# Altium schematic sheet 驱动PCB第4次.SchDoc
size A4
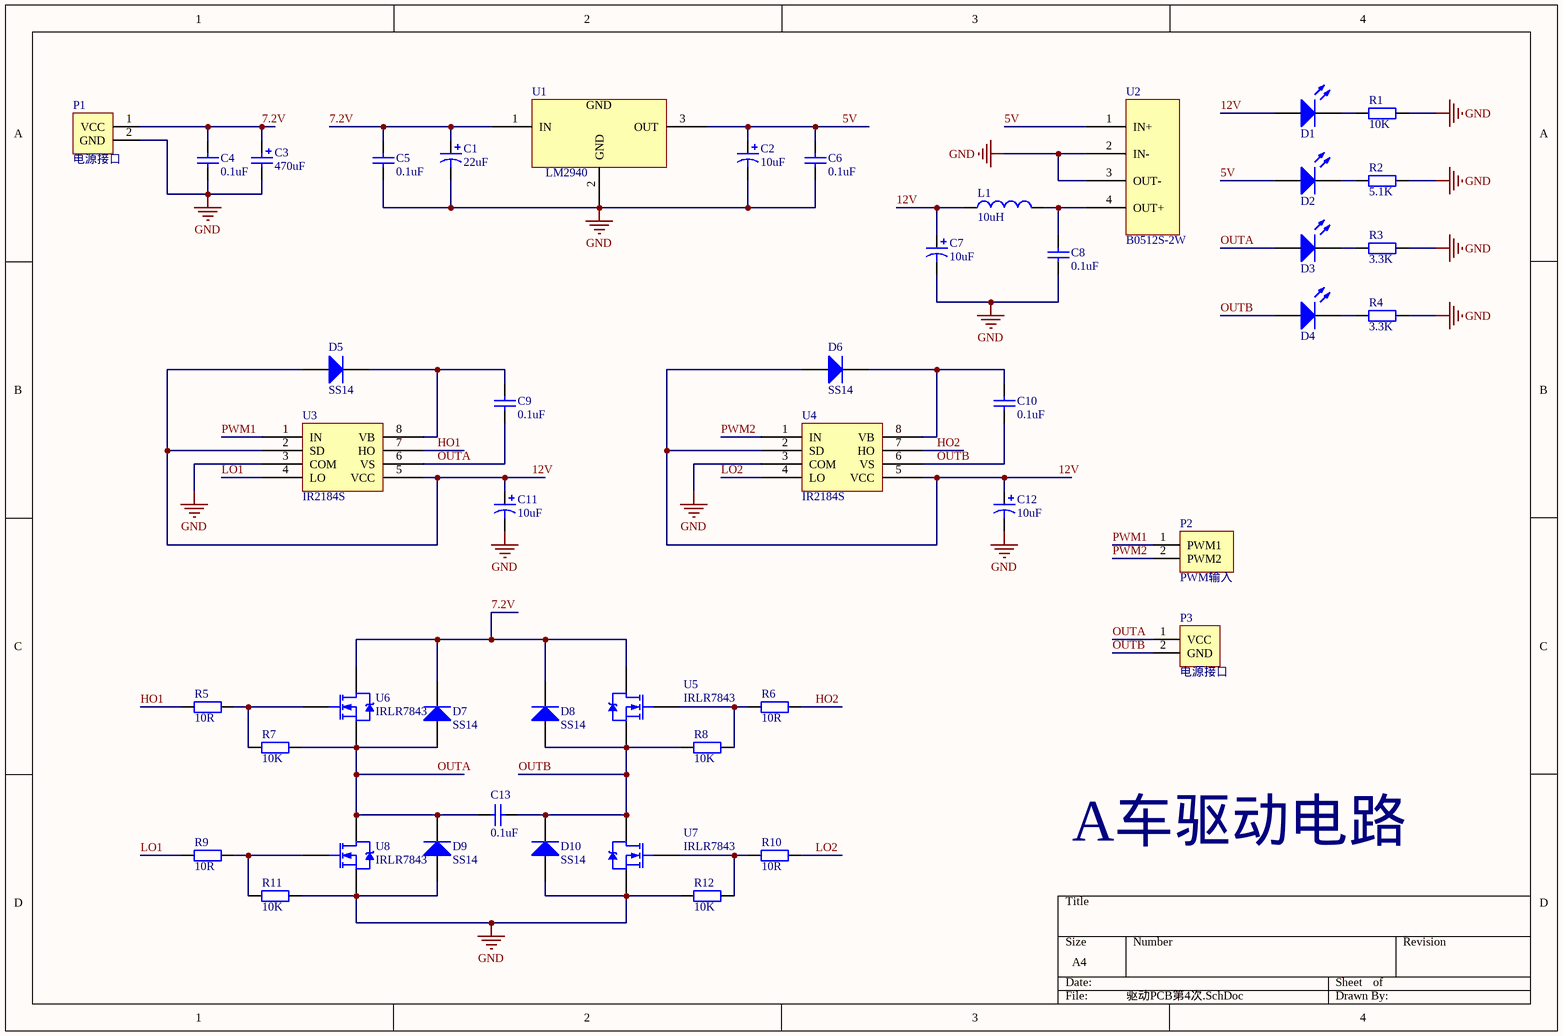
[diagram p0: 驱动PCB第4次.SchDoc]

## Parts
C1  value 22uF  [22uf钽电容]  (hidden comment: C-22uf钽电容)
C2  value 10uF  [10uf钽电容]  (hidden comment: C-10uf钽电容)
C3  value 470uF  [C-470uF电解电容]  (hidden comment: C-470电解电容)
C4  value 0.1uF  [0805]  (hidden comment: C-0.1uf)
C5  value 0.1uF  [0805]  (hidden comment: C-0.1uf)
C6  value 0.1uF  [0805]  (hidden comment: C-0.1uf)
C7  value 10uF  [10uf钽电容]  (hidden comment: C-10uf钽电容)
C8  value 0.1uF  [0805]  (hidden comment: C-0.1uf)
C9  value 0.1uF  [0805]  (hidden comment: C-0.1uf)
C10  value 0.1uF  [0805]  (hidden comment: C-0.1uf)
C11  value 10uF  [10uf钽电容]  (hidden comment: C-10uf钽电容)
C12  value 10uF  [10uf钽电容]  (hidden comment: C-10uf钽电容)
C13  value 0.1uF  [0805]  (hidden comment: C-0.1uf)
D1  LED0  [LED]  (value not drawn)
D2  LED0  [LED]  (value not drawn)
D3  LED0  [LED]  (value not drawn)
D4  LED0  [LED]  (value not drawn)
D5  SS14  [二极管SS14 6032MM]
D6  SS14  [二极管SS14 6032MM]
D7  SS14  [二极管SS14 6032MM]
D8  SS14  [二极管SS14 6032MM]
D9  SS14  [二极管SS14 6032MM]
D10  SS14  [二极管SS14 6032MM]
L1  value 10uH  [0805]  (hidden comment: Inductor)
P1  电源接口  [14AWG接口x2]
P2  PWM输入  [PWM接口]
P3  电源接口  [14AWG接口x2]
R1  value 10K  [0805]  (hidden comment: Res2)
R2  value 5.1K  [0805]  (hidden comment: Res2)
R3  value 3.3K  [0805]  (hidden comment: Res2)
R4  value 3.3K  [0805]  (hidden comment: Res2)
R5  value 10R  [0805]  (hidden comment: Res2)
R6  value 10R  [0805]  (hidden comment: Res2)
R7  value 10K  [0805]  (hidden comment: Res2)
R8  value 10K  [0805]  (hidden comment: Res2)
R9  value 10R  [0805]  (hidden comment: Res2)
R10  value 10R  [0805]  (hidden comment: Res2)
R11  value 10K  [0805]  (hidden comment: Res2)
R12  value 10K  [0805]  (hidden comment: Res2)
U1  LM2940  [lm2940]
U2  B0512S-2W  [MICRODC5-15]
U3  IR2184S  [IR2184S]
U4  IR2184S  [IR2184S]
U5  IRLR7843  [IRLR7843]
U6  IRLR7843  [IRLR7843]
U7  IRLR7843  [IRLR7843]
U8  IRLR7843  [IRLR7843]

## Nets
GND: C1.2 C2.2 C3.2 C4.2 C5.1 C6.1 C7.2 C8.1 C11.2 C12.2 D9.1(A) D10.1(A) P1.2(GND) R1.2 R2.2 R3.2 R4.2 R11.2 R12.1 U1.2(GND) U2.2(IN-) U2.3(OUT-) U3.3(COM) U4.3(COM) U7.3(S) U8.3(S)
5V: C2.1 C6.2 D2.1(A) U1.3(OUT) U2.1(IN+)
7.2V: C1.1 C3.1 C4.1 C5.2 D7.2(K) D8.2(K) P1.1(VCC) U1.1(IN) U5.2(D) U6.2(D)
12V: C7.1 C11.1 C12.1 D1.1(A) D5.1(A) D6.1(A) L1.1 U3.2(SD) U3.5(VCC) U4.2(SD) U4.5(VCC)
HO1: R5.1 U3.7(HO)
HO2: R6.2 U4.7(HO)
LO1: R9.1 U3.4(LO)
LO2: R10.2 U4.4(LO)
OUTA: C9.1 C13.1 D3.1(A) D7.1(A) D9.2(K) P3.1(VCC) R7.2 U3.6(VS) U6.3(S) U8.2(D)
OUTB: C10.1 C13.2 D4.1(A) D8.1(A) D10.2(K) P3.2(GND) R8.1 U4.6(VS) U5.3(S) U7.2(D)
PWM1: P2.1(PWM1) U3.1(IN)
PWM2: P2.2(PWM2) U4.1(IN)
NetC8_2: C8.2 L1.2 U2.4(OUT+)
NetC9_2: C9.2 D5.2(K) U3.8(VB)
NetC10_2: C10.2 D6.2(K) U4.8(VB)
NetD1_2: D1.2(K) R1.1
NetD2_2: D2.2(K) R2.1
NetD3_2: D3.2(K) R3.1
NetD4_2: D4.2(K) R4.1
NetR5_2: R5.2 R7.1 U6.1(G)
NetR6_1: R6.1 R8.2 U5.1(G)
NetR9_2: R9.2 R11.1 U8.1(G)
NetR10_1: R10.1 R12.2 U7.1(G)

## Notes on the sheet
- A车驱动电路

## Library data of the parts
C1 = C-22uf钽电容: Polarized Capacitor (Axial)
C2 C7 C11 C12 = C-10uf钽电容: Polarized Capacitor (Axial)
C3 = C-470电解电容: Polarized Capacitor (Surface Mount); Published: 8-Jun-2000; LatestRevisionDate: 29-May-2009; LatestRevisionNote: IPC-7351 Footprint Added.; PackageReference: C0805; Publisher: Altium Limited; PackageDescription: Chip Capacitor
C4-C6 C8-C10 C13 = C-0.1uf: Capacitor; Published: 8-Jun-2000; LatestRevisionDate: 17-Jul-2002; LatestRevisionNote: Re-released for DXP Platform.; PackageReference: RAD-0.3; Publisher: Altium Limited; PackageDescription: Radial Cap, Thru-Hole; 2 Leads; 0.3 in Pin Spacing
D1-D4 = LED0: Typical INFRARED GaAs LED; Published: 8-Jun-2000; LatestRevisionDate: 08-Jul-2005; LatestRevisionNote: Mech Layer 1 removed.; PackageReference: LED-0; Publisher: Altium Limited; PackageDescription: LED; 2 Leads
D5-D10 = Diode: Default Diode
L1 = Inductor: Code_IEC: 1005; Published: 8-Jun-2000; LatestRevisionDate: 29-May-2009; LatestRevisionNote: IPC-7351 Footprint Added.; PackageReference: 0402-A; Publisher: Altium Limited; PackageDescription: Chip Inductor; Code_JEITA: 0402
P1 P3 = 电源接口: Header, 2-Pin; LatestRevisionDate: 17-Jul-2002; LatestRevisionNote: Re-released for DXP Platform.; Publisher: Altium Limited
P2 = PWM输入: Header, 2-Pin; LatestRevisionDate: 17-Jul-2002; LatestRevisionNote: Re-released for DXP Platform.; Publisher: Altium Limited
R1-R12 = Res2: Resistor; Published: 8-Jun-2000; LatestRevisionDate: 17-Jul-2002; LatestRevisionNote: Re-released for DXP Platform.; PackageReference: AXIAL-0.4; Publisher: Altium Limited; PackageDescription: Axial Device, Thru-Hole; 2 Leads; 0.4 in Pin Spacing
U1 = LM2940: 1A Low Dropout Regulator
U5-U8 = IRLR7843: HEXFET Power MOSFET; Note: Pin 2 is electrically connected to pin 4.; Published: 8-Jun-2000; LatestRevisionDate: 17-Jul-2002; LatestRevisionNote: Re-released for DXP Platform.; DatasheetVersion: Aug-1997; PackageVersion: Feb-1997; PackageReference: TO-220AB; Publisher: Altium Limited; PackageDescription: TO, Thru-Hole, Vertical, Heatsink Mounted; 3 In-Line Leads; Pitch 2.54 mm; ComponentLink1Description: Manufacturer Link; ComponentLink1URL: http://www.irf.com/; ComponentLink2Description: Datasheet; ComponentLink2URL: http://www.irf.com/product-info/datasheets/data/irf3205.pdf